# Altium schematic sheet Connectors.SchDoc
size A; SheetNumber: 3; SheetTotal: 3
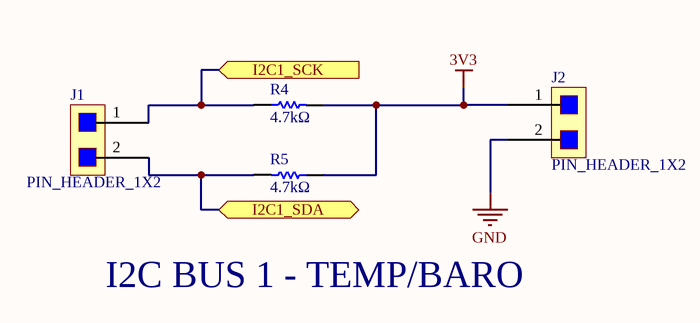
[diagram p0: Connectors.SchDoc]

## Parts
J1  PIN_HEADER_1X2  [PIN_HEADER - 1X2]
J2  PIN_HEADER_1X2  [PIN_HEADER - 1X2]
R4  value 4.7kΩ  [RES0603]  (hidden comment: RES_4.7kΩ_0603)
R5  value 4.7kΩ  [RES0603]  (hidden comment: RES_4.7kΩ_0603)

## Ports
I2C1_SCK (in), I2C1_SDA (bidir)

## Nets
3V3: J2.1 R4.2 R5.1
GND: J2.2
I2C1_SCK: J1.1 R4.1 ; port I2C1_SCK
I2C1_SDA: J1.2 R5.2 ; port I2C1_SDA

## Notes on the sheet
- I2C BUS 1 - TEMP/BARO

## Library data of the parts
J1 J2 = PIN_HEADER_1X2: Board Connector, 1 Contact(s), 1 Row(s), Male, Straight, Solder Terminal; Manufacturer: Sullins; Manufacturer Part Number: PREC001SAAN-RC; Option: General Purpose; Filter Feature: No; Number of Rows Loaded: 1; Supplier 1: Digi-Key; RoHS: Yes; Category: Connectors; Stock 1: 16681; Pricing 1: 1=0.04000, 10=0.03000, 25=0.02800, 50=0.02080, 100=0.01780, 250=0.01724, 500=0.01486 (USD); Mount: Board; Connector Type: BOARD CONNECTOR; Contact Gender: Male; Mixed Contacts: No; Mounting Style: STRAIGHT; Termination: Solder; Number of Contacts: 1; Flammability Rating: UL94 V-0; DIN Conformance: No; IEC Conformance: No; MIL Conformance: No; ComponentLink1URL: https://datasheet.ciiva.com:443/pdfs/VipMasterIC/IC/SUCS/SUCS-S-A0005121173/SUCS-S-A0005121173-1.pdf?src-supplier=IHS+Markit; ComponentLink1Description: https://datasheet.ciiva.com:443/pdfs/VipMasterIC/IC/SUCS/SUCS-S-A0005121173/SUCS-S-A0005121173-1.pdf?src-supplier=IHS+Markit; ComponentLink2URL: https://datasheet.ciiva.com/740/zrzczzzszzn-rc-st-11635-b-740844.pdf?src-supplier=Digi-Key; ComponentLink2Description: https://datasheet.ciiva.com/740/zrzczzzszzn-rc-st-11635-b-740844.pdf?src-supplier=Digi-Key; Supplier Part Number 1: S1012EC-01-ND
R4 R5 = RES_4.7kΩ_0603_5%: RES 4.7K OHM 5% 1/10W 0603; Manufacturer 1: Yageo; Manufacturer Part Number 1: RC0603JR-074K7L; Supplier Part Number 1: 311-4.7KGRCT-ND; Supplier 1: Digi-Key